# EAGLE design untitled (EAGLE 9.2.2)
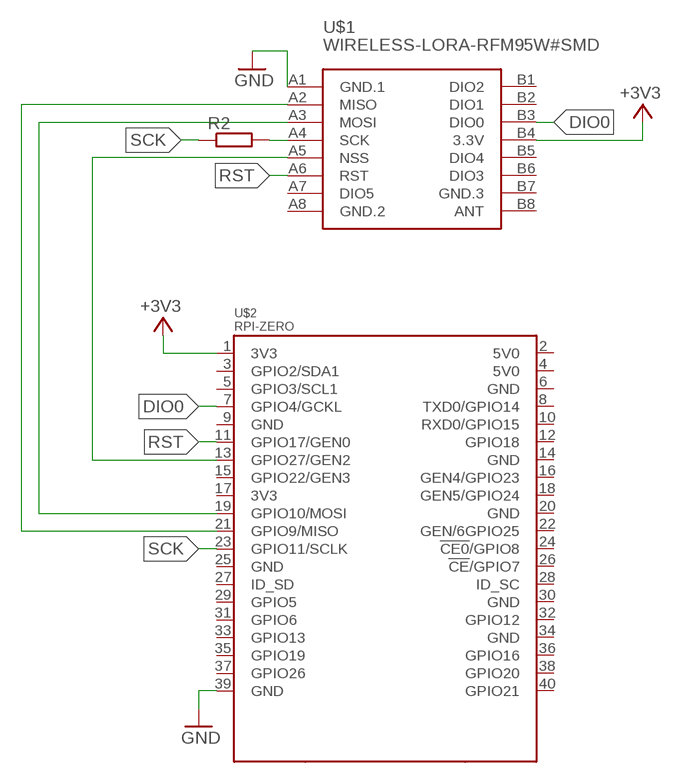
[diagram p0: schematic, sheet 1]

## Parts
R2  R-EU_0204/5  [0204/5]
U$1  WIRELESS-LORA-RFM95W#SMD  [WIRELESS-LORA-RFM95W#SMD]
U$2  RPI-ZERO  [RASPBERRYPI_BASTELSTUBE_V13_RASPI_BOARD_B+_FULL]

## Nets
+3V3: U$1.B4(3.3V) U$2.1(3V3)
DIO0: U$1.B3(DIO0) U$2.7(GPIO4/GCKL)
GND: U$1.A1(GND.1) U$2.39(GND)
N$1: U$1.A3(MOSI) U$2.19(GPIO10/MOSI)
N$3: R2.2 U$1.A4(SCK)
N$4: U$1.A5(NSS) U$2.13(GPIO27/GEN2)
N$5: U$1.A2(MISO) U$2.21(GPIO9/MISO)
RST: U$1.A6(RST) U$2.11(GPIO17/GEN0)
SCK: R2.1 U$2.23(GPIO11/SCLK)
Unconnected: U$1.A7(DIO5) U$1.B1(DIO2) U$1.B2(DIO1) U$1.B5(DIO4) U$1.B6(DIO3) U$1.B8(ANT) U$2.2(5V0) U$2.3(GPIO2/SDA1) U$2.4(5V0) U$2.5(GPIO3/SCL1) U$2.6(GND) U$2.8(TXD0/GPIO14) U$2.9(GND) U$2.10(RXD0/GPIO15) U$2.12(GPIO18) U$2.14(GND) U$2.15(GPIO22/GEN3) U$2.16(GEN4/GPIO23) U$2.17(3V3) U$2.18(GEN5/GPIO24) U$2.20(GND) U$2.22(GEN/6GPIO25) U$2.24(!CE0!/GPIO8) U$2.25(GND) U$2.26(!CE!/GPIO7) U$2.27(ID_SD) U$2.28(ID_SC) U$2.29(GPIO5) U$2.30(GND) U$2.31(GPIO6) U$2.32(GPIO12) U$2.33(GPIO13) U$2.34(GND) U$2.35(GPIO19) U$2.36(GPIO16) U$2.37(GPIO26) U$2.38(GPIO20) U$2.40(GPIO21)

## Power pins joined to a net without a drawn wire
GND.2: U$1.A8(GND.2)
GND.3: U$1.B7(GND.3)

## Library data of the parts
R2 = rcl:R-EU_: RESISTOR, European symbol; SPICEPREFIX: R
U$1 = diy-modules:WIRELESS-LORA-RFM95W: 868/915 MHz LoRa Radio Transceiver Module based on SX1276 chip Click here to find device on ebay.com <http://www.ebay.com/sch/RFM95W+transceiver>
U$2 = RPI-Zero:RPI-ZERO

## Board
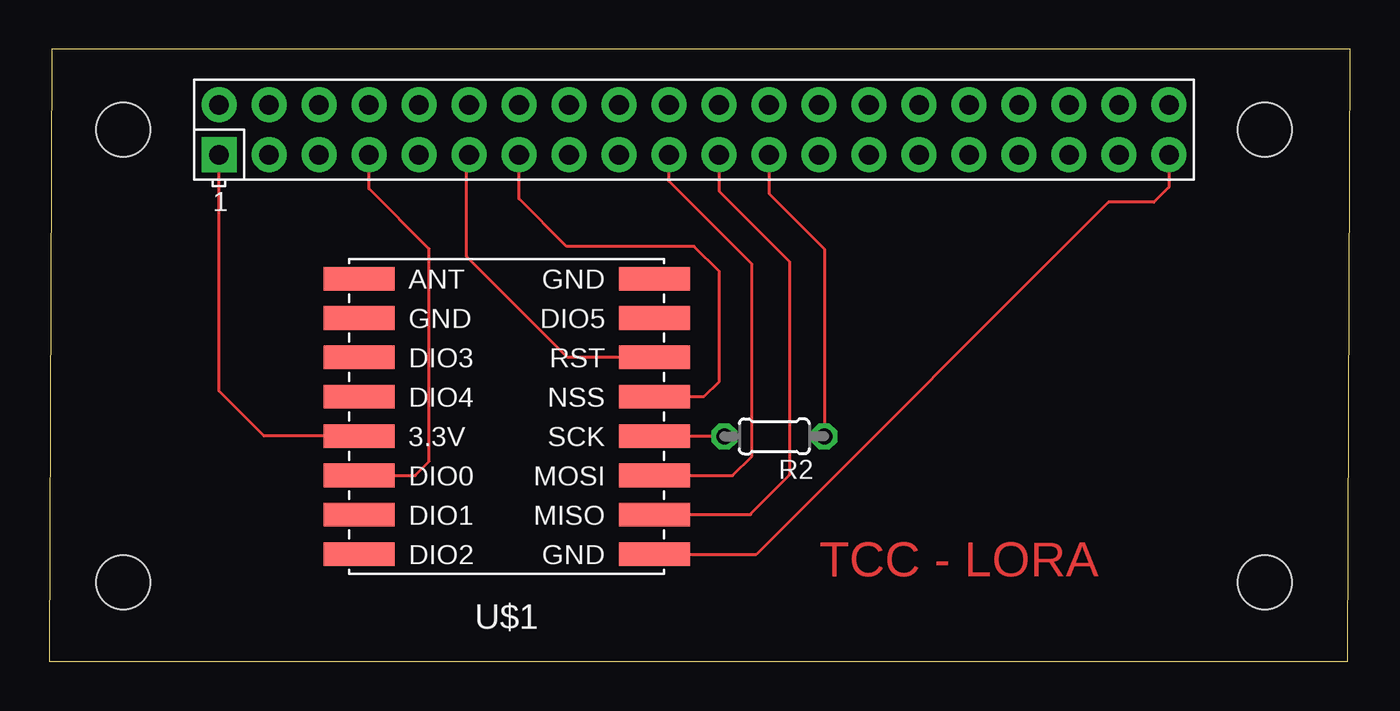
[diagram p1: board, top side]

Size 66.09 x 31.11 mm. Coordinates in mm from the lower left corner, seen from the top.
Outline: 0,0 65.96,0 66.09,31.11 0.13,31.11 0,0
Copper layers (1*16): Top 0.035mm / dielectric 1.5mm / Bottom 0.035mm
Design rules "default": minimum track width 6mil, minimum drill 0.35mm, track to track 6mil, track to pad 6mil, pad to pad 6mil, via to via 6mil, smd to smd 6mil, copper to edge 40mil, drill to drill 6mil, minimum pad ring 10mil, minimum via ring 8mil, stop-mask expansion 4mil, vias tented up to drill 0mil, thermal gap 10mil

### Footprints (pad centres in the part's own frame; a part is rotated, then mirrored left to right if it is on the bottom)
0204/5 = drill 0.813 octagon: 1 -2.54,0; 2 2.54,0
WIRELESS-LORA-RFM95W#SMD = smd 3.6 x 1.2: A1 -7.5,7; A2 -7.5,5; A3 -7.5,3; A4 -7.5,1; A5 -7.5,-1; A6 -7.5,-3; A7 -7.5,-5; A8 -7.5,-7; B1 7.5,7; B2 7.5,5; B3 7.5,3; B4 7.5,1; B5 7.5,-1; B6 7.5,-3; B7 7.5,-5; B8 7.5,-7
RASPBERRYPI_BASTELSTUBE_V13_RASPI_BOARD_B+_FULL = drill 1 pad 1.778 square: 1 8.37,25.23 | drill 1 pad 1.778: 2 8.37,27.77; 3 10.91,25.23; 4 10.91,27.77; 5 13.45,25.23; 6 13.45,27.77; 7 15.99,25.23; 8 15.99,27.77; 9 18.53,25.23; 10 18.53,27.77; 11 21.07,25.23; 12 21.07,27.77; 13 23.61,25.23; 14 23.61,27.77; 15 26.15,25.23; 16 26.15,27.77; 17 28.69,25.23; 18 28.69,27.77; 19 31.23,25.23; 20 31.23,27.77; 21 33.77,25.23; 22 33.77,27.77; 23 36.31,25.23; 24 36.31,27.77; 25 38.85,25.23; 26 38.85,27.77; 27 41.39,25.23; 28 41.39,27.77; 29 43.93,25.23; 30 43.93,27.77; 31 46.47,25.23; 32 46.47,27.77; 33 49.01,25.23; 34 49.01,27.77; 35 51.55,25.23; 36 51.55,27.77; 37 54.09,25.23; 38 54.09,27.77; 39 56.63,25.23; 40 56.63,27.77 | hole 2.75: 3.5,3.5; 3.5,26.5; 61.5,3.5; 61.5,26.5

### Placement (x,y rotation side)
R2  36.83,11.43 180 top
U$1  23.24,12.45 180 top
U$2  0.25,0.51 0 top

### Tracks (layer width: path | path; a pad name or v marks a point on that pad's centre or on a via)
+3V3
  Top 0.152: U$1.B4 10.91,11.45 8.62,13.73 U$2.1
DIO0
  Top 0.152: U$1.B3 18.59,9.45 19.3,10.16 19.3,20.95 16.24,24.02 U$2.7
GND
  Top 0.152: U$1.A1 35.93,5.45 53.8,23.32 56.12,23.32 56.88,24.09 U$2.39
N$1
  Top 0.152: U$1.A3 34.72,9.45 35.69,10.41 35.69,20.19 31.48,24.4 U$2.19
N$3
  Top 0.152: U$1.A4 34.27,11.45 R2.2
N$4
  Top 0.152: U$2.13 23.86,23.51 26.29,21.08 32.77,21.08 34.04,19.81 34.04,14.22 33.26,13.45 U$1.A5
N$5
  Top 0.152: 35.64,7.45 35.56,7.45 | 35.56,7.45 U$1.A2 | U$2.21 34.02,23.89 37.59,20.32 37.59,9.48 35.56,7.45
RST
  Top 0.152: U$1.A6 26.34,15.45 21.21,20.57 21.21,25.62 U$2.11
SCK
  Top 0.152: U$2.23 36.56,23.76 39.37,20.95 R2.1

### Text on the board
Top: TCC - LORA